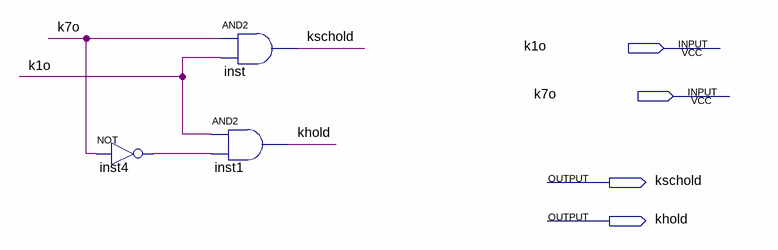
[diagram p0: schematic sheet]
// Quartus schematic kaiguanfuyong2.bdf as structural Verilog: 3 symbols, 4 pins
module kaiguanfuyong2 (
  input  k1o,
  input  k7o,
  output kschold,
  output khold
);

  wire inst4_out;

  not inst4 (inst4_out, k7o);
  and inst (kschold, k7o, k1o);
  and inst1 (khold, k1o, inst4_out);
endmodule
